# EAGLE design board (EAGLE 7.6.0)
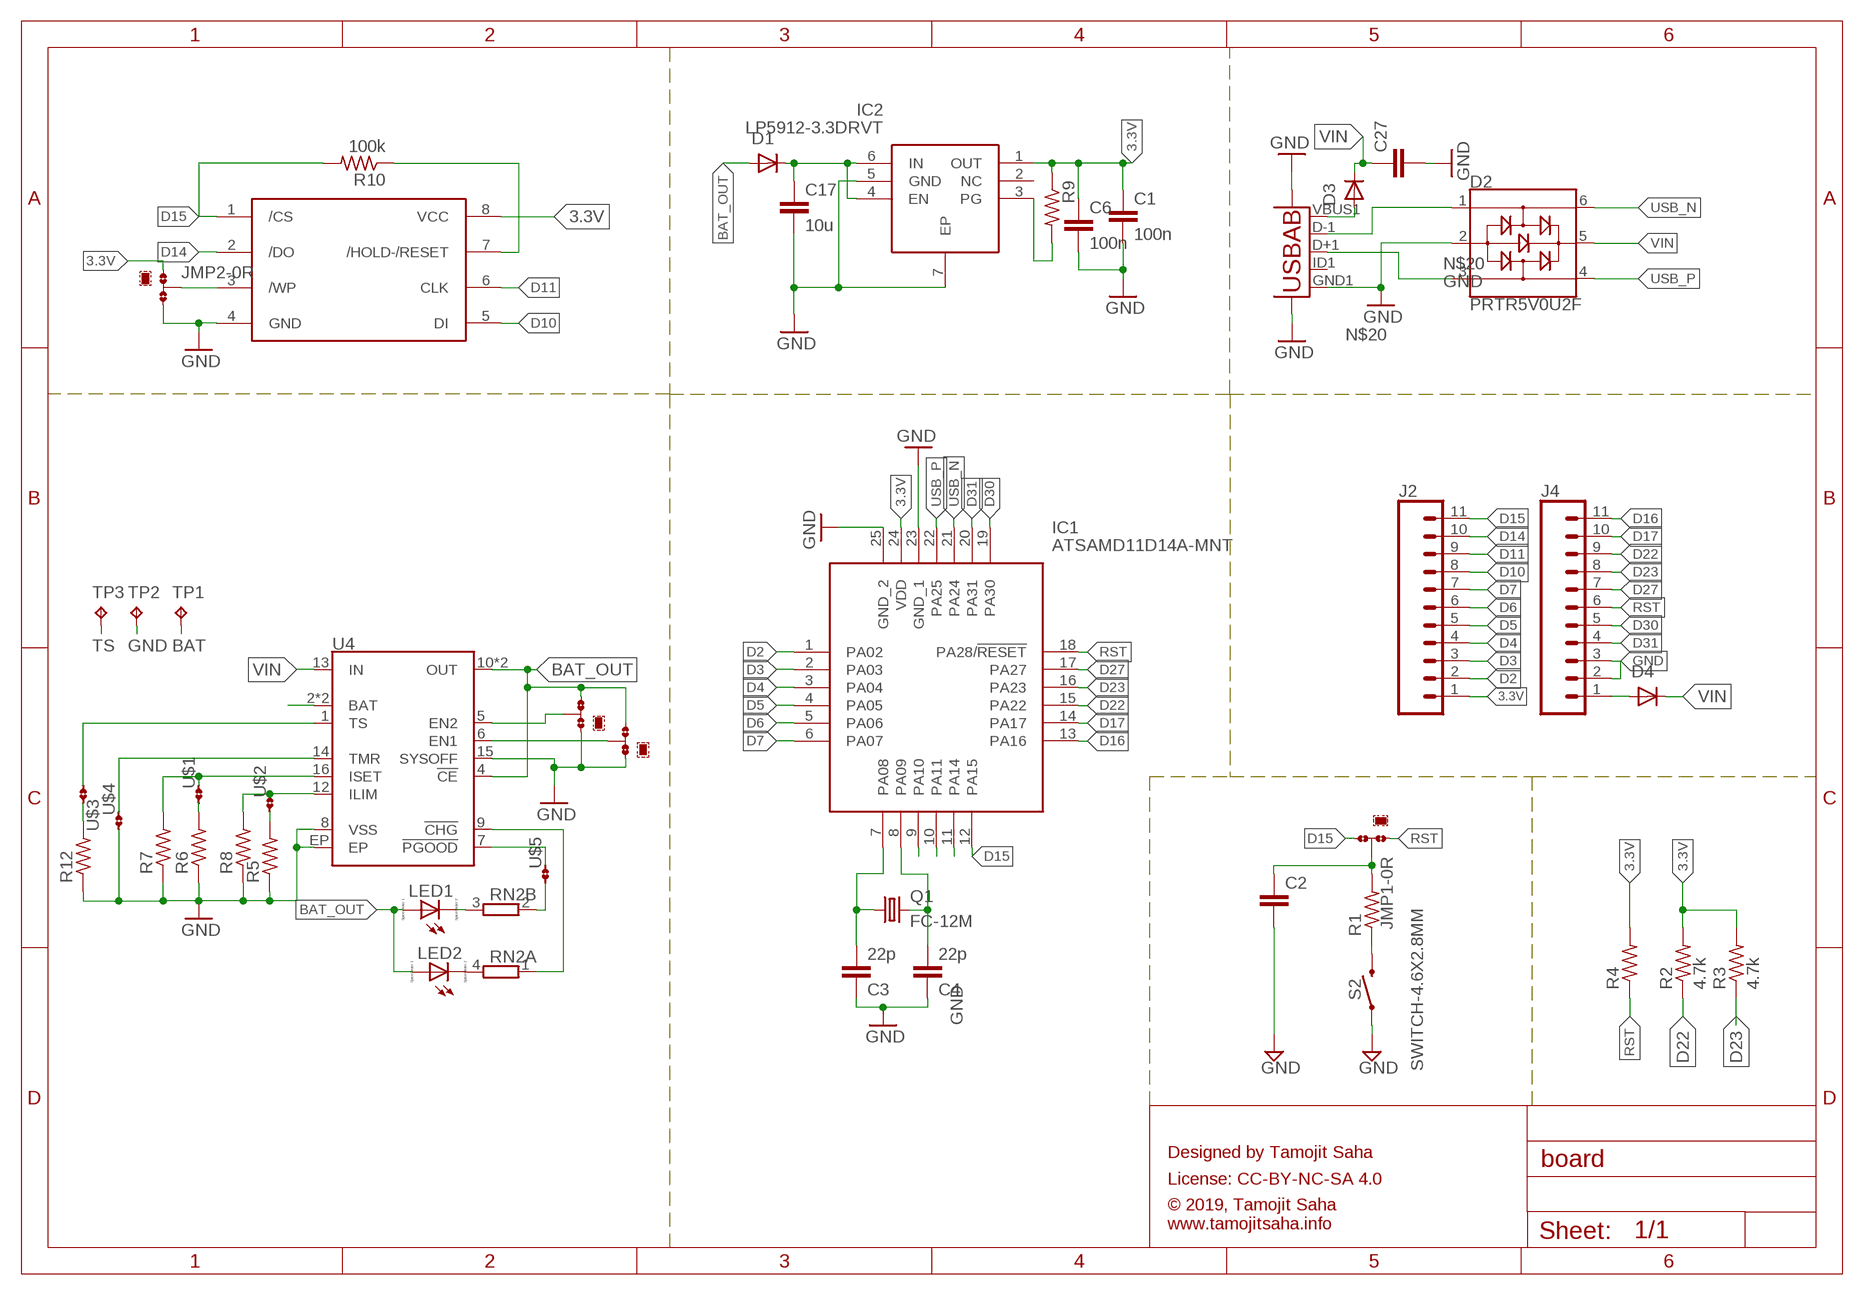
[diagram p0: schematic, sheet 1]

## Parts
C1  100n  C-EUC0402  [C0402]
C2  C-EUC0402  [C0402]
C3  22p  C-EUC0402  [C0402]
C4  22p  C-EUC0402  [C0402]
C6  100n  C-EUC0402  [C0402]
C17  10u  C-EUC0603  [C0603]
C27  C-EUC0603  [C0603]
D1  PMEG1030  [SOD323(F)]
D2  PRTR5V0U2F  [SOT886]
D3  PMEG1030  [SOD323(F)]
D4  PMEG1030  [SOD323(F)]
EEPROM1  W25Q128JVPIQ  [SON127P600X500X80-9N]
IC1  ATSAMD11D14A-MNT  [QFN50P400X400X90-25N]
IC2  LP5912-3.3DRVT  [WSON-6]
J2  CONN_111X11_NO_SILK  [1X11_NO_SILK]
J4  CONN_111X11_NO_SILK  [1X11_NO_SILK]
JMP1  0R-JUMPA  [A0R-JMP]
JMP2  0R-JUMPA  [A0R-JMP]
JMP3  0R-JUMPA  [A0R-JMP]
JMP4  0R-JUMPA  [A0R-JMP]
LED1  LED_ESML0603  [LED_SML0603]
LED2  LED_ESML0603  [LED_SML0603]
Q1  FC-12M  [FC-12M]
R1  R-US_R0402  [R0402]
R2  4.7k  R-US_R0402  [R0402]
R3  4.7k  R-US_R0402  [R0402]
R4  R-US_R0402  [R0402]
R5  R-US_R0402  [R0402]
R6  R-US_R0402  [R0402]
R7  R-US_R0402  [R0402]
R8  R-US_R0402  [R0402]
R9  R-US_R0402  [R0402]
R10  100k  R-US_R0402  [R0402]
R12  R-US_R0402  [R0402]
RN2  2R-NEXB24V  [EXB24V]
S2  SWITCH-4.6X2.8MM  MOMENTARY-SWITCH-SPST-SMD-4.6X2.8MM  [TACTILE_SWITCH_SMD_4.6X2.8MM]
TP1  TPB1,27  [B1,27]
TP2  TPB1,27  [B1,27]
TP3  TPB1,27  [B1,27]
U3  USB""  [USB-MICRO-SMD]
U4  BQ24075  [PVQFN-N16]
U$1  JMP-2-NO-0402  [JMP-2-NO-0402]
U$2  JMP-2-NO-0402  [JMP-2-NO-0402]
U$3  JMP-2-NO-0402  [JMP-2-NO-0402]
U$4  JMP-2-NO-0402  [JMP-2-NO-0402]
U$5  JMP-2-NO-0402  [JMP-2-NO-0402]

## Nets
3.3V: C1.1 C6.1 EEPROM1.8(VCC) IC1.24(VDD) IC2.1(OUT) J2.1 JMP2.1 R2.2 R3.2 R4.2 R9.1
BAT: TP1.TP U4.2(BAT) U4.3(BAT)
BAT_OUT [pwr]: D1.2(A) JMP3.3 JMP4.3 LED1.A LED2.A U4.4(!CE!) U4.10(OUT) U4.11(OUT)
D2: IC1.1(PA02) J2.2
D3: IC1.2(PA03) J2.3
D4: IC1.3(PA04) J2.4
D5: IC1.4(PA05) J2.5
D6: IC1.5(PA06) J2.6
D7: IC1.6(PA07) J2.7
D10: EEPROM1.5(DI) IC1.9(PA10) J2.8
D11: EEPROM1.6(CLK) IC1.10(PA11) J2.9
D14: EEPROM1.2(/DO) IC1.11(PA14) J2.10
D15: EEPROM1.1(/CS) IC1.12(PA15) J2.11 JMP1.3 R10.2
D16: IC1.13(PA16) J4.11
D17: IC1.14(PA17) J4.10
D22: IC1.15(PA22) J4.9 R2.1
D23: IC1.16(PA23) J4.8 R3.1
D27: IC1.17(PA27) J4.7
D30: IC1.19(PA30) J4.5
D31: IC1.20(PA31) J4.4
GND: C1.2 C2.2 C3.1 C4.1 C6.2 C17.2 C27.2 D2.2 EEPROM1.4(GND) IC1.23(GND_1) IC1.25(GND_2) IC2.5(GND) IC2.7(EP) J4.2 J4.3 JMP2.3 JMP3.1 JMP4.1 R5.1 R6.1 R7.1 R8.1 R12.1 S2.1 S2.2 TP2.TP U3.GND1(GND) U3.SH1 U3.SH2 U4.8(VSS) U4.15(SYSOFF) U4.EP U$4.1
N$1: LED1.C RN2.3
N$2: C3.2 IC1.7(PA08) Q1.1
N$3: D2.1 U3.D-1(D-)
N$4: D2.3 U3.D+1(D+)
N$5: R6.2 U$1.1
N$6: R7.2 U4.16(ISET) U$1.2
N$7: C4.2 IC1.8(PA09) Q1.2
N$8: C2.1 JMP1.2 R1.2
N$9: R12.2 U$3.2
N$10: R5.2 U$2.1
N$11: R8.2 U4.12(ILIM) U$2.2
N$12: U4.14(TMR) U$4.2
N$13: C17.1 D1.1(K) IC2.4(EN) IC2.6(IN)
N$14: JMP4.2 U4.5(EN2)
N$15: RN2.2 U$5.1
N$16: LED2.C RN2.4
N$17: JMP3.2 U4.6(EN1)
N$18: RN2.1 U4.9(!CHG!)
N$19: U4.7(!PGOOD!) U$5.2
N$20 [VIN]: D3.2(A) U3.VBUS1(VBUS)
N$21: D4.2(A) J4.1
N$22: IC2.3(PG) R9.2
N$23: EEPROM1.3(/WP) JMP2.2
N$24: EEPROM1.7(/HOLD-/RESET) R10.1
N$25: R1.1 S2.3 S2.4
RST: IC1.18(PA28/!RESET) J4.6 JMP1.1 R4.1
TS: TP3.TP U4.1(TS) U$3.1
USB_N [diff]: D2.6 IC1.21(PA24)
USB_P [diff]: D2.4 IC1.22(PA25)
VIN [VIN]: C27.1 D2.5 D3.1(K) D4.1(K) U4.13(IN)
Unconnected: IC2.2(NC) U3.ID1(USBID)

## Notes on the sheet
- Designed by Tamojit Saha
- License: CC-BY-NC-SA 4.0
- © 2019, Tamojit Saha
  www.tamojitsaha.info

## Library data of the parts
C1-C4 C6 C17 C27 = rcl_:C-EU: CAPACITOR, European symbol
D1 D3 D4 = PMEG1030EJ:PMEG1030: Single high-speed switching diode Single high-speed switching diode, encapsulated in a SOD323F (SC-90) very small and ?at lead Surface-Mounted Device (SMD) plastic package. AAL Eindhoven MK; AVAILABILITY: Unavailable; DESCRIPTION: DIODE, SWITCH, 300V, 0.25A, SOD323F; Diode Type: Fast Recovery; Forward Current I; MF: NXP Semiconductors; MP: BAS21J; PACKAGE: SOD-323 NXP Semiconductors; PRICE: None
D2 = SparkFun-IC-Power:PRTR5V0U2: A small ESD protection device. Most commonly used on USB D+/D- signals to protect large, expensive, or especially sensitive USB enabled devices.; PROD_ID: DIO-14084
EEPROM1 = Winbond W25Q128JVPIQ :W25Q128JVPIQ: EEPROM
IC1 = ATSAMD11D14A-MNT:ATSAMD11D14A-MNT: ARM Microcontrollers - MCU Cortex-M0+, 16KB FLASH,4KB SRAM, USB - 24 QFN,105C, GREEN,1.6-3.6V,48MHz,USB Source: Datasheet <https://componentsearchengine.com/Datasheets/1/ATSAMD11D14A-MNT.pdf>; DESCRIPTION: ARM Microcontrollers - MCU Cortex-M0+, 16KB FLASH,4KB SRAM, USB - 24 QFN,105C, GREEN,1.6-3.6V,48MHz,USB; HEIGHT: 0.9mm; MANUFACTURER_NAME: Microchip; MANUFACTURER_PART_NUMBER: ATSAMD11D14A-MNT; MOUSER_PART_NUMBER: 556-ATSAMD11D14A-MNT
IC2 = LP5912-3.3DRVT:LP5912-3.3DRVT: TEXAS INSTRUMENTS - LP5912-3.3DRVT - LINEAR VOLT REG, FIXED, 3.3V, 0.5A, WSON Source: Datasheet <http://www.ti.com/lit/ds/symlink/lp5912.pdf>; DESCRIPTION: TEXAS INSTRUMENTS - LP5912-3.3DRVT - LINEAR VOLT REG, FIXED, 3.3V, 0.5A, WSON; HEIGHT: 0.8mm; MANUFACTURER_NAME: Texas Instruments; MANUFACTURER_PART_NUMBER: LP5912-3.3DRVT; MOUSER_PART_NUMBER: 595-LP5912-3.3DRVT; MOUSER_PRICE-STOCK: https://www.mouser.com/Search/Refine.aspx?Keyword=595-LP5912-3.3DRVT; RS_PART_NUMBER: 595-LP5912-3.3DRVT; RS_PRICE-STOCK: https://www.mouser.com/Search/Refine.aspx?Keyword=595-LP5912-3.3DRVT
J2 J4 = XKB U-E-M5SS-W-4:CONN_11: Multi connection point. Often used as Generic Header-pin footprint for 0.1 inch spaced/style header connections On any of the 0.1 inch spaced packages, you can populate with these: Break Away Headers - Straight <https://www.sparkfun.com/products/116> (PRT-00116) Break Away Male Headers - Right Angle <https://www.sparkfun.com/products/553> (PRT-00553) Female Headers <https://www.sparkfun.com/products/115> (PRT-00115) Break Away Headers - Machine Pin <https://www.sparkfun.com/products/117> (PRT-00117) Break Away Female Headers - Swiss Machine Pin <https://www.sparkfun.com/products/743> (PRT-00743) For SCREWTERMINALS and SPRING TERMINALS visit here: Screw Terimnals on SparkFun.com <https://www.sparkfun.com/search/results?term=Screw+Terminals> (5mm/3.5mm/2.54mm spacing) This device is also useful as a general connection point to wire up your design to another part of your project. Our various solder wires solder well into these plated through hole pads. Hook-Up Wire - Assortment (Stranded, 22 AWG) <https://www.sparkfun.com/products/11375> (PRT-11375) Hook-Up Wire - Assortment (Solid Core, 22 AWG) <https://www.sparkfun.com/products/11367> (PRT-11367) View the entire wire category on our website here <https://www.sparkfun.com/categories/141>
JMP1-JMP4 = jump-0r-smd:0R-JUMP: SMD 0R 0805 Jumper
LED1 LED2 = eagle-ltspice:LED_E: LED Source: http://www.osram.convergy.de Source: www.luxeon.com Source: www.kingbright.com; SPICEMODEL: NONE; SPICEPREFIX: D; SPICETYPE: diode
Q1 = crystal:FC-12M: kHz RANGE CRYSTAL UNIT LOW PROFILE SMD Source: Epson Toyocom FC-12M.pdf
R1-R10 R12 = rcl_:R-US_: RESISTOR, American symbol
RN2 = resistor-dil:2R-N: Array Chip Resistor Source: Panasonic; OC_FARNELL: unknown; OC_NEWARK: unknown
S2 = SparkFun-Switches:MOMENTARY-SWITCH-SPST: Momentary Switch (Pushbutton) - SPST Normally-open (NO) SPST momentary switches (buttons, pushbuttons). Variants PTH-12MM - 12mm square, through-hole Momentary Pushbutton Switch - 12mm Square <https://www.sparkfun.com/products/9190> (COM-09190) PTH-6.0MM, PTH-6.0MM-KIT - 6.0mm square, through-hole Mini Pushbutton Switch <https://www.sparkfun.com/products/97> (COM-00097) KIT package intended for soldering kit's - only one side of pads' copper is exposed. PTH-RIGHT-ANGLE-KIT - Right-angle, through-hole Right Angle Tactile Button <https://www.sparkfun.com/products/10791> - Used on SparkFun BigTime Watch Kit <https://www.sparkfun.com/products/11734> SMD-12MM - 12mm square, surface-mount Tactile Button - SMD (12mm) <https://www.sparkfun.com/products/12993> (COM-12993) Used on SparkFun PicoBoard <https://www.sparkfun.com/products/11888> SMD-4.5MM - 4.5mm Square Trackball Switch Used on SparkFun Blackberry Trackballer Breakout <https://www.sparkfun.com/products/13169> SMD-4.6MMX2.8MM - 4.60mm x 2.80mm, surface mount Used on SparkFun SAMD21 Mini Breakout <https://www.sparkfun.com/products/13664> SMD-5.2MM, SMD-5.2-REDUNDANT - 5.2mm square, surface-mount Mini Pushbutton Switch - SMD <https://www.sparkfun.com/products/8720> (COM-08720) Used on Arduino Pro Mini <https://www.sparkfun.com/products/11114> REDUNDANT package connects both switch circuits together SMD-6.0X3.5MM - 6.0 x 3.5mm, surface mount Momentary Reset Switch SMD <https://www.sparkfun.com/products/8229> (COM-08229) SMD-6.2MM-TALL - 6.2mm square, surface mount Tactile Button - SMD (6mm) <https://www.sparkfun.com/products/12992> Used on SparkFun Digital Sandbox <https://www.sparkfun.com/products/12651> SMD-RIGHT-ANGLE - Right-angle, surface mount Used on SparkFun Block for Intel® Edison - Arduino <https://www.sparkfun.com/products/13036>; PROD_ID: SWCH-13065
TP1-TP3 = testpad:TP: Test pad
U3 = MicroUSB:USB: This is a USB AB connector that is compatible with USB OTG. i.e. this connector can serve as a host or device
U4 = SparkFun-IC-Power:BQ24075: Texas Instruments BQ24075 LiPo Battery Chargerand Power-Path Management IC The bq2407x series of devices are integrated Li-Ion linear chargers and system power path management devices targeted at space-limited portable applications. The devices operate from either a USB port or an AC adapter and support charge currents up to 1.5 A. The input voltage range with input overvoltage protection supports unregulated adapters. The USB input current limit accuracy and start up sequence allow the bq2407x to meet USB-IF inrush current specifications. Additionally, the input dynamic power management (VIN-DPM) prevents the charger from crashing incorrectly configured USB sources. Datasheet <http://www.ti.com/product/BQ24075/datasheet> SparkFun Products SparkFun Battery Babysitter <https://www.sparkfun.com/products/13777> (PRT-13777); PROD_ID: IC-13219
U$1-U$5 = PatternAgents-ProtoPads:JMP-2-NO: Two Terminal Jumper - Normally Open Positions 1 and 2 are normally NOT connected. PatternAgents ProtoPads Library Schematic and PCB layout libraries for design patterns by PatternAgents. For the CADSoft Eagle CAD program : http://www.cadsoftusa.com/download-eagle/ Source LBR : http://www.patternagents.com Github : https://github.com/PatternAgents License : http://creativecommons.org/licenses/by-sa/4.0/ (Creative Commons 4.0) THIS SOFTWARE IS PROVIDED BY THE CONTRIBUTORS "AS IS" AND WITHOUT ANY EXPRESS OR IMPLIED WARRANTIES, INCLUDING, BUT NOT LIMITED TO, THE IMPLIED WARRANTIES OF MERCHANTABILITY AND FITNESS FOR A PARTICULAR PURPOSE ARE DISCLAIMED. IN NO EVENT SHALL THE COPYRIGHT OWNER OR CONTRIBUTORS BE LIABLE FOR ANY DIRECT, INDIRECT, INCIDENTAL, SPECIAL, EXEMPLARY, OR CONSEQUENTIAL DAMAGES (INCLUDING, BUT NOT LIMITED TO, PROCUREMENT OF SUBSTITUTE GOODS OR SERVICES; LOSS OF USE, DATA, OR PROFITS; OR BUSINESS INTERRUPTION) HOWEVER CAUSED AND ON ANY THEORY OF LIABILITY, WHETHER IN CONTRACT, STRICT LIABILITY, OR TORT (INCLUDING NEGLIGENCE OR OTHERWISE) ARISING IN ANY WAY OUT OF THE USE OF THIS SOFTWARE, EVEN IF ADVISED OF THE POSSIBILITY OF SUCH DAMAGE.; BOM: EXCLUDE

## Net classes
0 default: width 0.152 mm, drill 0.254 mm, clearance 0.152 mm
1 ss: width 0.203 mm, drill 0.254 mm, clearance 0.152 mm
2 pwr: width 0.203 mm, drill 0.356 mm, clearance 0.203 mm
3 VIN: width 0.254 mm, clearance 0.203 mm
4 diff: width 0.152 mm, clearance 0.152 mm

## Board
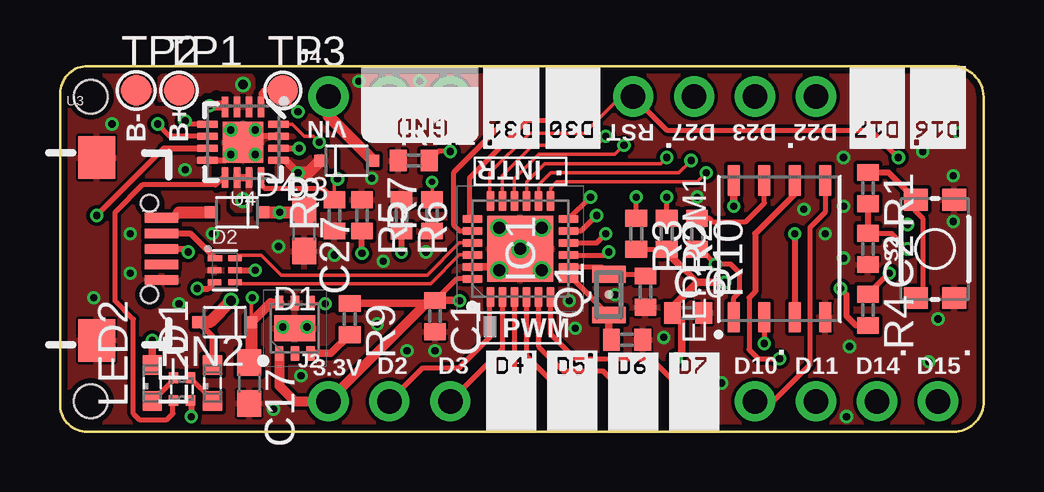
[diagram p1: board, top side]
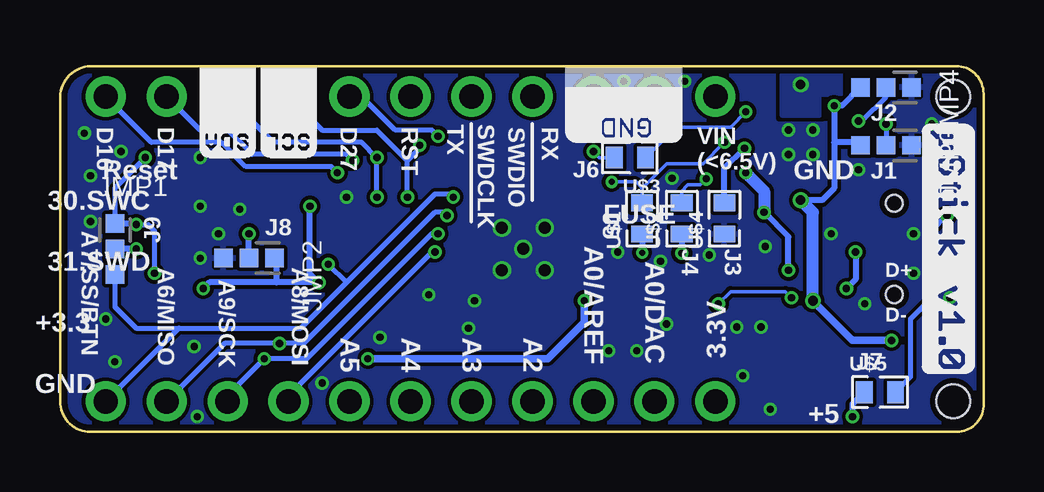
[diagram p2: board, bottom side, seen from below]

Size 38.49 x 15.24 mm. Coordinates in mm from the lower left corner, seen from the top.
Outline: 1.02,0 37.22,0 arc90 38.49,1.27 38.49,13.97 arc85 37.22,15.24 1.15,15.24 arc90 0.01,14.1 0.01,1.27 arc90 1.02,0
Copper layers (1*16): Top 0.035mm / dielectric 1.5mm / Bottom 0.035mm
Design rules "SparkFun-2-layer-FAB-LIMIT *": minimum track width 6mil, minimum drill 10mil, track to track 5mil, track to pad 5mil, pad to pad 5mil, via to via 6mil, smd to smd 5mil, copper to edge 10mil, drill to drill 4mil, minimum pad ring 5mil, minimum via ring 5mil, stop-mask expansion 4mil, vias tented up to drill 25mil, thermal gap 4mil
Holes 1.4 mm at 1.28,13.97 1.28,1.27

### Footprints (pad centres in the part's own frame; a part is rotated, then mirrored left to right if it is on the bottom)
C0402 = smd 0.7 x 0.9: 1 -0.65,0; 2 0.65,0
C0603 = smd 1.1 x 1: 1 -0.85,0; 2 0.85,0
SOD323(F) = smd 0.5 x 0.5: 1 1.1,0; 2 -1.1,0
SOT886 = smd 0.61 x 0.25: 1 -0.405,0.5 | smd 0.56 x 0.25: 2 -0.43,0; 3 -0.43,-0.5; 4 0.43,-0.5; 5 0.43,0; 6 0.43,0.5
SON127P600X500X80-9N = smd 1.27 x 0.508: 1 -2.845,1.905; 2 -2.845,0.635; 3 -2.845,-0.635; 4 -2.845,-1.905; 5 2.845,-1.905; 6 2.845,-0.635; 7 2.845,0.635; 8 2.845,1.905
QFN50P400X400X90-25N = smd 0.8 x 0.3: 1 -2,1.25; 2 -2,0.75; 3 -2,0.25; 4 -2,-0.25; 5 -2,-0.75; 6 -2,-1.25; 13 2,-1.25; 14 2,-0.75; 15 2,-0.25; 16 2,0.25; 17 2,0.75; 18 2,1.25 | smd 0.3 x 0.8: 7 -1.25,-2; 8 -0.75,-2; 9 -0.25,-2; 10 0.25,-2; 11 0.75,-2; 12 1.25,-2; 19 1.25,2; 20 0.75,2; 21 0.25,2; 22 -0.25,2; 23 -0.75,2; 24 -1.25,2 | smd 2.75 x 2.75: 25 0,0
WSON-6 = smd 0.6 x 0.35: 1 -1.05,0.65; 2 -1.05,0; 3 -1.05,-0.65; 4 1.05,-0.65; 5 1.05,0; 6 1.05,0.65 | smd 1.1 x 1.7: 7 0,0
1X11_NO_SILK = drill 1.016 pad 1.676: 1 0,0; 2 2.54,0; 3 5.08,0; 4 7.62,0; 5 10.16,0; 6 12.7,0; 7 15.24,0; 8 17.78,0; 9 20.32,0; 10 22.86,0; 11 25.4,0
A0R-JMP = smd 0.762 x 0.762: 1 0,1.065; 2 0,0; 3 0,-1.065
LED_SML0603 = smd 0.8 x 0.8: A 0.75,0; C -0.75,0
FC-12M = smd 0.7 x 1.4: 1 -0.85,0; 2 0.85,0
R0402 = smd 0.7 x 0.9: 1 -0.65,0; 2 0.65,0
EXB24V = smd 0.4 x 0.45: 1 -0.35,-0.475; 2 0.35,-0.475; 3 0.35,0.475; 4 -0.35,0.475
TACTILE_SWITCH_SMD_4.6X2.8MM = smd 0.9 x 1: 1 -2.05,-0.8; 2 2.05,-0.8; 3 2.05,0.8; 4 -2.05,0.8
B1,27 = smd 1.27 x 1.27: TP 0,0
USB-MICRO-SMD = smd 1.4 x 0.4: D+1 2.7,0; D-1 2.7,0.65; GND1 2.7,-1.3; ID1 2.7,-0.65; VBUS1 2.7,1.3 | smd 1.524 x 1.778: SH1 0,-3.81; SH2 0,3.81 | hole 0.7: 2.2,1.9; 2.2,-1.9
PVQFN-N16 = smd 0.28 x 0.85: 1 -0.75,-1.475; 2 -0.25,-1.475; 3 0.25,-1.475; 4 0.75,-1.475; 9 0.75,1.475; 10 0.25,1.475; 11 -0.25,1.475; 12 -0.75,1.475 | smd 0.85 x 0.28: 5 1.475,-0.75; 6 1.475,-0.25; 7 1.475,0.25; 8 1.475,0.75; 13 -1.475,0.75; 14 -1.475,0.25; 15 -1.475,-0.25; 16 -1.475,-0.75 | smd 1.7 x 1.7: EP 0,0
JMP-2-NO-0402 = smd 0.7 x 0.9: 1 -0.65,0; 2 0.65,0

### Placement (x,y rotation side)
C1  15.63,4.83 270 top
C2  33.66,7.62 270 top
C3  23.63,3.84 180 top
C4  24.39,5.84 90 top
C6  26.17,4.95 0 top
C17  7.88,2.03 270 top
C27  10.17,8.38 270 top
D1  6.86,4.57 0 top
D2  6.86,6.73 0 top
D3  7.37,9.14 0 top
D4  11.94,11.3 180 top
EEPROM1  29.98,7.62 90 top
IC1  19.18,7.62 90 top
IC2  9.79,4.32 90 top
J2  11.18,1.27 0 top
J4  11.18,13.97 0 top
JMP1  36.2,7.62 0 bottom
JMP2  30.61,7.24 270 bottom
JMP3  4.07,11.94 270 bottom
JMP4  4.07,14.35 270 bottom
LED1  6.36,2.03 90 top
LED2  3.84,2.03 90 top
Q1  22.87,5.72 90 top
R1  33.66,10.16 270 top
R2  25.28,8.25 270 top
R3  24.01,8.25 270 top
R4  33.66,5.08 270 top
R5  12.58,9.02 270 top
R6  14.23,9.02 270 top
R7  15.5,9.02 90 top
R8  11.44,9.02 90 top
R9  12.07,4.7 270 top
R10  26.55,8.25 270 top
R12  14.74,11.3 0 top
RN2  5.09,1.78 0 top
S2  36.46,7.62 90 top
TP1  4.96,14.22 0 top
TP2  3.18,14.22 0 top
TP3  9.28,14.22 0 top
U3  1.53,7.62 0 top
U4  7.63,12.06 180 top
U$1  14.23,8.89 90 bottom
U$2  12.58,8.89 90 bottom
U$3  14.74,11.43 180 bottom
U$4  10.8,8.89 90 bottom
U$5  4.32,1.65 0 bottom

### Tracks (layer width: path | path; a pad name or v marks a point on that pad's centre or on a via)
3.3V  (via drill 0.3)
  Top 0.203: R3.2 R2.2 25.28,7.49 | IC1.24 16.54,6.37 15.64,5.48 C1.1
  Top 0.254: R4.2 33.17,4.43 32.77,4.83 32.77,5.72 v32.52,5.97 | 25.79,6.99 26.55,6.22 | C6.1 25.52,5.19
  Top 0.305: v16.64,5.46 16.63,5.48 C1.1 15.5,5.35 R9.1 | EEPROM1.8 v28.07,9.4 | 25.28,7.49 25.79,6.99 | v27.69,6.22 26.55,6.22 25.52,5.19 | v25.66,3.05 25.91,3.3 25.91,4.56 C6.1
  Top 0.406: C1.1 15.61,5.46 | 15.39,5.48 J2.1 9.79,1.27 9.14,1.92 IC2.1
  Top 0.508: 15.39,5.48 C1.1
  Bottom 0.254: 29.47,6.22 v27.69,6.22 28.07,6.6 v28.07,9.4 | 29.47,6.22 32.26,6.22 v32.52,5.97 | JMP2.1 29.47,7.16 29.47,6.22
  Bottom 0.305: v25.66,3.05 18.17,3.05 16.64,4.57 v16.64,5.46
BAT  (via drill 0.4)
  other vias: 7.63,14.48
  pour Top (isolate 0.203, rank 2): 7.25,13.46 7.25,14.1 7.12,14.22 5.98,14.22 5.34,13.59 4.45,13.59 4.2,13.84 4.2,14.73 4.45,14.99 7.75,14.99 8.01,14.73 8.01,13.46
  pour Bottom (rank 2): 6.86,13.21 6.86,14.1 5.98,14.1 5.98,14.86 8.39,14.86 8.39,13.21
BAT_OUT  (via drill 0.3, 0.4, 0.4 pad 0.61)
  Top 0.254: LED1.A 6.36,3.98 D1.2
  Top 0.305: U4.4 6.83,13.59 | U4.10 U4.11 | v3.84,3.81 LED2.A
  Top 0.406: 6.83,13.59 v6.23,13.59
  Top 0.508: v7.12,5.46 6.23,4.57 D1.2
  Bottom 0.254: 6.23,12.06 v6.23,13.59 5.9,13.59 JMP4.3 | 6.23,12.06 6.23,10.16 6.74,9.65 v7.63,9.65 | JMP3.3 5.26,12.06 6.23,12.06
  Bottom 0.305: v3.84,3.81 5.47,3.81 v7.12,5.46
  Bottom 0.508: v7.12,5.46 7.12,9.14 v7.63,9.65
  pour Top (isolate 0.203): 7.25,11.05 8.01,11.05 8.01,9.4 7.88,9.27 7.37,9.27 7.25,9.4
D2
  Top 0.203: IC1.1 17.91,5.6 17.91,3.94 16.64,2.67 15.12,2.67 J2.2
D3
  Top 0.203: IC1.2 18.43,3.44 J2.3
D4
  Top 0.203: IC1.3 18.93,1.4
  Top 0.254: 18.93,1.4 J2.4
D5
  Top 0.203: IC1.4 19.43,3.18 J2.5
D6
  Top 0.203: IC1.5 19.93,3.57 20.96,2.54 22.61,2.54 J2.6
D7
  Top 0.203: IC1.6 20.43,4.08 21.47,3.05 24.64,3.05 J2.7
D10  (via drill 0.3)
  Top 0.203: IC1.9 22.74,7.37 v22.87,7.49 | EEPROM1.5 31.88,9.14 31.25,8.51 31.25,2.79 29.72,1.27 J2.8
  Top 0.254: IC1.9
  Bottom 0.152: 22.99,7.49 v22.87,7.49
  Bottom 0.203: 22.99,7.49 28.96,1.52 J2.8
D11  (via drill 0.3)
  Top 0.203: IC1.10 22.36,7.87 v22.74,8.25 | 28.96,5.84 28.71,5.59 28.71,3.43 29.09,3.05 v29.98,3.05
  Top 0.254: IC1.10 | EEPROM1.6 30.61,9.91 28.96,8.25 28.96,5.84
  Bottom 0.203: J2.9 31.5,1.52 v29.98,3.05 28.58,3.05 28.2,3.05 22.99,8.25 v22.74,8.25
D14  (via drill 0.3)
  Top 0.203: IC1.11 21.72,8.38 v22.36,9.02 | EEPROM1.2 v29.34,3.68
  Top 0.254: IC1.11
  Bottom 0.203: J2.10 31.63,3.68 v29.34,3.68 28.33,3.68 22.87,9.14 22.49,9.14 v22.36,9.02
D15  (via drill 0.3)
  Top 0.152: 22.09,9.78 v22.1,9.78
  Top 0.203: IC1.12 22.09,9.78 | R10.2 26.69,7.6 v27.31,6.99 27.95,6.99 28.33,6.6 28.33,5.84 28.07,5.59 EEPROM1.1
  Top 0.254: EEPROM1.1 28,4.77
  Bottom 0.152: v22.1,9.78 22.23,9.91
  Bottom 0.203: 22.23,9.91 22.87,9.91 26.55,6.22 | 26.55,6.22 28.45,4.32 33.53,4.32 | JMP1.3 36.2,5.21 35.31,4.32 33.53,4.32 | v27.31,6.99 26.55,6.22 | J2.11 33.53,4.32
D16  (via drill 0.3)
  Top 0.152: IC1.13 20.45,9.62 20.45,10.16 20.71,10.41 26.55,10.41 v26.93,10.79
  Bottom 0.203: v26.93,10.79 27.18,11.05 30.74,11.05 31.76,12.06 34.68,12.06 J4.11
D17  (via drill 0.3)
  Top 0.152: IC1.14 19.95,10.29 20.45,10.79 25.79,10.79 v26.3,11.3
  Top 0.203: IC1.14
  Bottom 0.203: v26.3,11.3 26.55,11.56 30.49,11.56 31.5,12.57 32.65,12.57 J4.10
D22  (via drill 0.3)
  Top 0.152: IC1.15 19.44,10.41 20.2,11.18 25.03,11.18 v25.28,11.43
  Top 0.203: IC1.15 | R2.1 v25.28,9.78
  Bottom 0.203: v25.28,9.78 v25.28,11.43 25.91,12.06 29.6,12.06 J4.9
D23  (via drill 0.3)
  Top 0.152: IC1.16 18.93,10.54 19.95,11.56 23.12,11.56 v23.5,11.94
  Top 0.203: IC1.16 | R3.1 v24.01,9.78
  Bottom 0.203: v24.01,9.78 24.01,11.3 | J4.8 27.57,12.57 25.28,12.57 24.01,11.3 | 24.01,11.3 23.5,11.81 v23.5,11.94
D27  (via drill 0.3)
  Top 0.152: 18.42,9.63 18.42,10.67 19.69,11.94 22.36,11.94 v22.74,12.32
  Top 0.203: IC1.17 18.42,9.63
  Bottom 0.203: v22.74,12.32 22.99,12.57 24.52,12.57 25.91,13.97 J4.7
D30
  Top 0.203: J4.5 20.33,12.95 19.44,12.95 17.06,10.57 17.06,9 IC1.19
D31
  Top 0.203: 17.17,8.38 IC1.20 16.66,8.37 16.39,8.64 16.39,10.79 18.8,13.21 J4.4
GND  (via drill 0.3, 0.5)
  Top 0.254: U4.15 8.39,12.32 v8.13,12.57 | U4.EP v7.12,11.56 6.88,11.31 U4.8
  Top 0.305: IC1.23 18.16,6.87 v18.29,6.73
  other vias: 15.63,3.38 14.46,3.38 36.2,2.92 32.65,9.4 36.58,4.7 18.29,8.51 20.07,8.51 20.07,6.73 19.18,7.62 21.47,4.32 21.22,5.46 25.15,3.94 23.12,5.72 37.47,12.45 31.88,8.25 37.22,8.76 9.28,4.37 12.99,10.57 11.44,7.37 7.12,12.57 8.13,11.56 5.21,10.92 6.36,8.25 9.1,7.72 12.45,14.61 32.65,7.24 37.22,10.67 13.47,7.11 4.96,5.33 13.21,4.5 27.57,2.03 30.99,9.27 32.65,11.43 32.9,3.56 26.55,9.78 15.25,7.49 10.29,4.37 8.9,0.94 1.4,5.59 2.17,12.83 10.04,2.34 2.93,6.6 2.93,8.25 35.95,11.68 32.77,0.63 14.99,14.61 17.02,12.7
  pour Bottom (isolate 0.152, rank 3): -0.5,15.37 38.87,15.37 38.87,-0.51 -0.5,-0.51
  pour Top (isolate 0.152, rank 3): -1.14,16 40.14,16 40.14,-1.14 -1.14,-1.14
N$1
  Top 0.203: RN2.3 6.36,1.33 LED1.C
N$2
  Top 0.203: IC1.7 21.36,6.37 Q1.1 23.36,4.86
  Top 0.305: Q1.1 22.87,3.95 C3.2
N$3
  Top 0.254: U3.D-1 5.42,8.27 D2.1
N$4  (via drill 0.3)
  Top 0.254: U3.D+1 5.21,7.62 v5.34,7.49 | v5.72,5.97 6.17,5.97 D2.3
  Bottom 0.254: v5.34,7.49 5.34,6.35 v5.72,5.97
N$5  (via drill 0.25)
  Top 0.254: v14.23,7.47 R6.2
  Bottom 0.254: U$1.1 v14.23,7.47
N$6  (via drill 0.25, 0.3)
  Top 0.152: U4.16 9.67,12.81 10.17,12.32 10.55,12.32 v10.8,12.06 | v15.5,10.41 R7.2
  Bottom 0.152: U$1.2 14.23,10.16 | v10.8,12.06 11.69,11.18 13.21,11.18 14.23,10.16 | 14.23,10.16 14.48,10.41 v15.5,10.41
N$7
  Top 0.203: IC1.8 22.56,6.87 Q1.2 24.32,6.57 C4.2
N$8  (via drill 0.3)
  Top 0.203: C2.1 34.66,8.27 v35.31,7.62
  Top 0.254: R1.2 C2.1
  Bottom 0.254: v35.31,7.62 JMP1.2
N$9  (via drill 0.3)
  Top 0.203: v16.26,11.68 15.77,11.68 R12.2
  Bottom 0.152: v16.26,11.68 16.01,11.43 U$3.2
N$10  (via drill 0.3)
  Top 0.254: v12.58,7.44 R5.2
  Bottom 0.254: U$2.1 v12.58,7.44
N$11  (via drill 0.3)
  Top 0.152: v11.56,10.54 11.44,10.41 R8.2 11.42,9.67
  Top 0.203: U4.12 8.38,10.3 8.52,10.16 10.94,10.16 R8.2
  Bottom 0.152: U$2.2 12.58,10.03 12.33,10.29 11.82,10.29 v11.56,10.54
N$12  (via drill 0.3)
  Top 0.152: U4.14
  Top 0.254: U4.14 v9.96,11.81
  Bottom 0.254: U$4.2 10.8,10.97 v9.96,11.81
N$13  (via drill 0.3)
  Top 0.152: IC2.4 10.47,5.33 v11.06,5.33 | v8.01,5.59 7.96,5.54 D1.1
  Top 0.406: D1.1 8.76,5.37 IC2.6
  Top 0.508: 7.7,3.06 C17.1 7.96,2.97 D1.1
  Bottom 0.152: v11.06,5.33 10.55,5.84 8.26,5.84 v8.01,5.59
N$14  (via drill 0.3)
  Top 0.203: U4.5 5.35,12.81 v5.21,12.95
  Bottom 0.203: v5.21,12.95 5.09,12.95 4.07,13.97 JMP4.2
N$15  (via drill 0.3)
  Top 0.254: RN2.2 5.47,1.3 v5.47,0.63
  Bottom 0.254: U$5.1 5.47,1.16 v5.47,0.63
N$16
  Top 0.203: LED2.C 4.74,2.18 RN2.4
N$17  (via drill 0.3)
  Top 0.203: U4.6 4.58,12.31 v4.07,12.83
  Bottom 0.203: v4.07,12.83 JMP3.2
N$18
  Top 0.203: U4.9 6.79,10.59 6.48,10.29 3.44,10.29 2.29,9.14 2.29,5.46 3.05,4.7 3.05,0.76 3.31,0.51 4.45,0.51 4.71,0.76 4.71,1.27 RN2.1
N$19  (via drill 0.3)
  Top 0.203: v1.53,9.02 4.32,11.81
  Top 0.254: 4.32,11.81 U4.7
  Bottom 0.203: U$5.2 3.67,1.67 3.05,2.29 3.05,4.7 2.17,5.59 2.17,8.38 v1.53,9.02
N$20
  Top 0.406: U3.VBUS1 4.74,8.92 4.96,9.14
  Top 0.508: 4.96,9.14 D3.2
N$21
  Top 0.508: J4.1 11.18,13.16 D4.2
N$22
  Top 0.305: IC2.3 11.29,3.27 R9.2
N$23  (via drill 0.3)
  Top 0.254: v30.61,8.25 EEPROM1.3
  Bottom 0.254: JMP2.2 v30.61,8.25
N$24
  Top 0.203: R10.1 27.04,8.91 27.18,8.76 28.58,8.76 29.34,9.52 EEPROM1.7
N$25
  Top 0.203: S2.3 35.66,9.18 35.95,8.89 35.95,5.86 S2.4
  Top 0.254: R1.1 34.52,10.81 S2.3
RST  (via drill 0.3)
  Top 0.152: 17.91,9.64 17.91,10.79 19.56,12.45 21.85,12.45 23.37,13.97
  Top 0.203: IC1.18 17.91,9.64 | v34.93,11.43 33.79,12.57 25.28,12.57 J4.6 23.37,13.97 | v34.55,6.6 34.54,6.6 R4.1
  Bottom 0.203: v34.93,11.43 36.2,10.16 JMP1.1 | v35.31,8.64 34.8,8.64 34.55,8.38 v34.55,6.6
  Bottom 0.254: JMP1.1 35.36,8.68 v35.31,8.64
TS  (via drill 0.3)
  Top 0.152: TP3.TP 9.28,13.97 v9.91,13.33
  Top 0.254: TP3.TP 8.52,14.22 8.39,14.1 U4.1
  Bottom 0.152: v9.91,13.33 10.55,12.7 12.82,12.7 U$3.1
USB_N
  Top 0.152: IC1.21 16.64,7.87 15.3,6.53 9.23,6.53 8.39,7.37 7.43,7.37 D2.6 7.49,7.23
USB_P
  Top 0.152: IC1.22 16.64,7.37 15.45,6.17 7.35,6.17 D2.4
  Top 0.203: IC1.22 arc-90 IC1.22
VIN  (via drill 0.3)
  Top 0.254: U4.13 9.14,11.31 | D2.5 v8.13,6.73
  Top 0.305: v9.91,10.79 9.39,11.31 U4.13
  Top 0.406: 10.08,9.14 C27.1
  Top 0.508: D3.1 v9.15,9.14 10.08,9.14 | D4.1 10.34,10.79 v9.91,10.79
  Bottom 0.254: v8.13,6.73 8.13,8.13 v9.15,9.14
  Bottom 0.508: v9.91,10.79 9.15,10.03 v9.15,9.14
  pour Top (isolate 0.152, rank 2): 8.64,11.56 9.66,11.56 9.91,11.3 10.17,11.3 10.55,11.68 11.31,11.68 11.44,11.56 11.44,10.92 11.31,10.79 11.18,10.79 10.8,10.41 8.9,10.41 8.77,10.54 8.77,11.05 8.64,11.18

### Text on the board
tPlace: VIN | B- | B+ | RST | D27 | D23 | D22 | INTR | . | . | . | PWM | 3.3V | D3 | . | . | . | D2 | D10 | D11 | D14 | D15
bPlace: J2 | RX | SWDIO | SWDCLK | TX | RST | D27 | D17 | D16 | VIN / (<6.5V) | J6 | J1 | J5 | J8 | A7/SS/BTN | J3 | J4 | A0/DAC | A0/AREF | J9 | A8/MOSI | A9/SCK | A6/MISO | 3.3V | A2 | A3 | A4 | A5 | J7
bNames: GND | Reset | 30.SWC | FUSE | D+ | 31.SWD | D- | +3.3 | GND | +5